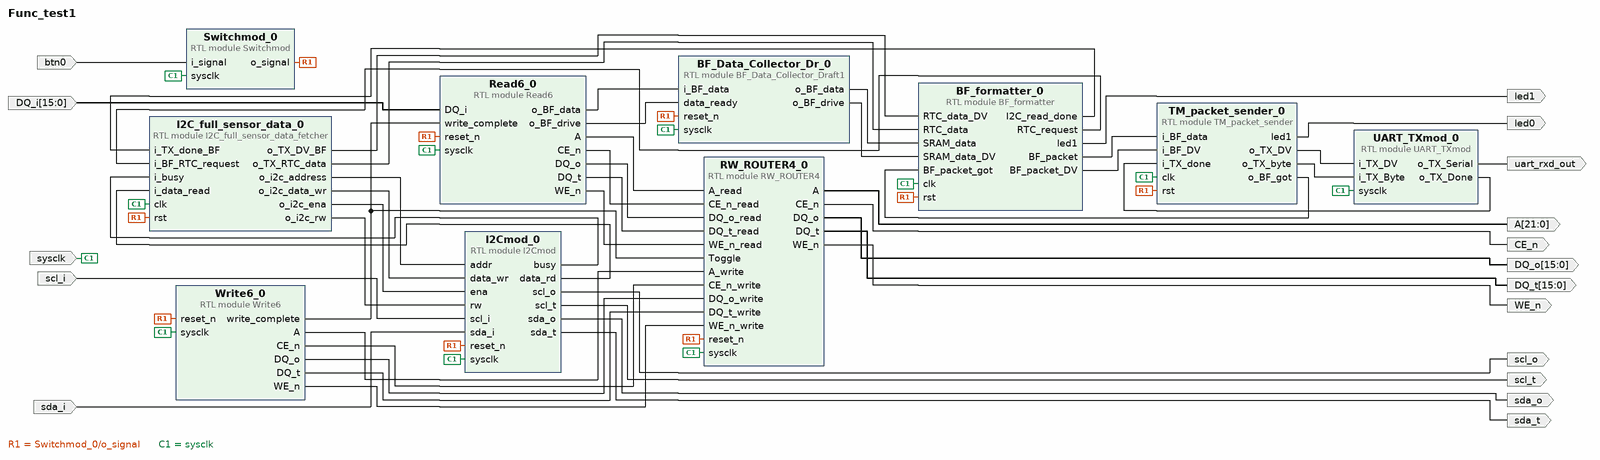
[diagram p0: block diagram of the top level]
# Vivado block design Func_test1, xc7a35tcpg236-1, Vivado 2024.2
create_bd_design Func_test1

create_bd_port -dir I sysclk
create_bd_port -dir I btn0
create_bd_port -dir O led0
create_bd_port -dir I -from 15 -to 0 DQ_i
create_bd_port -dir O -from 15 -to 0 DQ_o
create_bd_port -dir O -from 15 -to 0 DQ_t
create_bd_port -dir O WE_n
create_bd_port -dir O CE_n
create_bd_port -dir O -from 21 -to 0 A
create_bd_port -dir O led1
create_bd_port -dir I sda_i
create_bd_port -dir I scl_i
create_bd_port -dir O sda_o
create_bd_port -dir O uart_rxd_out
create_bd_port -dir O sda_t
create_bd_port -dir O scl_o
create_bd_port -dir O scl_t

create_bd_cell -type module -reference BF_Data_Collector_Draft1 BF_Data_Collector_Dr_0
create_bd_cell -type module -reference Read6 Read6_0
create_bd_cell -type module -reference Write6 Write6_0
create_bd_cell -type module -reference RW_ROUTER4 RW_ROUTER4_0
create_bd_cell -type module -reference Switchmod Switchmod_0
create_bd_cell -type module -reference BF_formatter BF_formatter_0
create_bd_cell -type module -reference I2C_full_sensor_data_fetcher I2C_full_sensor_data_0
create_bd_cell -type module -reference TM_packet_sender TM_packet_sender_0
create_bd_cell -type module -reference UART_TXmod UART_TXmod_0
create_bd_cell -type module -reference I2Cmod I2Cmod_0

# ---- connections ----

connect_bd_net [get_bd_pins BF_Data_Collector_Dr_0/o_BF_data] [get_bd_pins BF_formatter_0/SRAM_data]
connect_bd_net [get_bd_pins BF_Data_Collector_Dr_0/o_BF_drive] [get_bd_pins BF_formatter_0/SRAM_data_DV]
connect_bd_net [get_bd_pins BF_formatter_0/BF_packet] [get_bd_pins TM_packet_sender_0/i_BF_data]
connect_bd_net [get_bd_pins BF_formatter_0/BF_packet_DV] [get_bd_pins TM_packet_sender_0/i_BF_DV]
connect_bd_net [get_bd_pins BF_formatter_0/I2C_read_done] [get_bd_pins I2C_full_sensor_data_0/i_TX_done_BF]
connect_bd_net [get_bd_pins BF_formatter_0/RTC_request] [get_bd_pins I2C_full_sensor_data_0/i_BF_RTC_request]
connect_bd_net [get_bd_pins BF_formatter_0/led1] [get_bd_ports led1]
connect_bd_net -net DQ_i_0_1 [get_bd_ports DQ_i] [get_bd_pins Read6_0/DQ_i]
connect_bd_net [get_bd_pins I2C_full_sensor_data_0/o_TX_DV_BF] [get_bd_pins BF_formatter_0/RTC_data_DV]
connect_bd_net [get_bd_pins I2C_full_sensor_data_0/o_TX_RTC_data] [get_bd_pins BF_formatter_0/RTC_data]
connect_bd_net [get_bd_pins I2C_full_sensor_data_0/o_i2c_address] [get_bd_pins I2Cmod_0/addr]
connect_bd_net [get_bd_pins I2C_full_sensor_data_0/o_i2c_data_wr] [get_bd_pins I2Cmod_0/data_wr]
connect_bd_net [get_bd_pins I2C_full_sensor_data_0/o_i2c_ena] [get_bd_pins I2Cmod_0/ena]
connect_bd_net [get_bd_pins I2C_full_sensor_data_0/o_i2c_rw] [get_bd_pins I2Cmod_0/rw]
connect_bd_net [get_bd_pins I2Cmod_0/busy] [get_bd_pins I2C_full_sensor_data_0/i_busy]
connect_bd_net [get_bd_pins I2Cmod_0/data_rd] [get_bd_pins I2C_full_sensor_data_0/i_data_read]
connect_bd_net [get_bd_pins I2Cmod_0/scl_o] [get_bd_ports scl_o]
connect_bd_net [get_bd_pins I2Cmod_0/scl_t] [get_bd_ports scl_t]
connect_bd_net [get_bd_pins I2Cmod_0/sda_o] [get_bd_ports sda_o]
connect_bd_net [get_bd_pins I2Cmod_0/sda_t] [get_bd_ports sda_t]
connect_bd_net [get_bd_pins RW_ROUTER4_0/A] [get_bd_ports A]
connect_bd_net [get_bd_pins RW_ROUTER4_0/CE_n] [get_bd_ports CE_n]
connect_bd_net [get_bd_pins RW_ROUTER4_0/DQ_o] [get_bd_ports DQ_o]
connect_bd_net [get_bd_pins RW_ROUTER4_0/DQ_t] [get_bd_ports DQ_t]
connect_bd_net [get_bd_pins RW_ROUTER4_0/WE_n] [get_bd_ports WE_n]
connect_bd_net [get_bd_pins Read6_0/A] [get_bd_pins RW_ROUTER4_0/A_read]
connect_bd_net [get_bd_pins Read6_0/CE_n] [get_bd_pins RW_ROUTER4_0/CE_n_read]
connect_bd_net [get_bd_pins Read6_0/DQ_o] [get_bd_pins RW_ROUTER4_0/DQ_o_read]
connect_bd_net [get_bd_pins Read6_0/DQ_t] [get_bd_pins RW_ROUTER4_0/DQ_t_read]
connect_bd_net [get_bd_pins Read6_0/WE_n] [get_bd_pins RW_ROUTER4_0/WE_n_read]
connect_bd_net [get_bd_pins Read6_0/o_BF_data] [get_bd_pins BF_Data_Collector_Dr_0/i_BF_data]
connect_bd_net [get_bd_pins Read6_0/o_BF_drive] [get_bd_pins BF_Data_Collector_Dr_0/data_ready]
connect_bd_net [get_bd_pins Switchmod_0/o_signal] \
  [get_bd_pins RW_ROUTER4_0/reset_n] [get_bd_pins Write6_0/reset_n] [get_bd_pins BF_Data_Collector_Dr_0/reset_n] \
  [get_bd_pins I2C_full_sensor_data_0/rst] [get_bd_pins Read6_0/reset_n] [get_bd_pins TM_packet_sender_0/rst] \
  [get_bd_pins BF_formatter_0/rst] [get_bd_pins I2Cmod_0/reset_n]
connect_bd_net [get_bd_pins TM_packet_sender_0/led1] [get_bd_ports led0]
connect_bd_net [get_bd_pins TM_packet_sender_0/o_BF_got] [get_bd_pins BF_formatter_0/BF_packet_got]
connect_bd_net [get_bd_pins TM_packet_sender_0/o_TX_DV] [get_bd_pins UART_TXmod_0/i_TX_DV]
connect_bd_net [get_bd_pins TM_packet_sender_0/o_TX_byte] [get_bd_pins UART_TXmod_0/i_TX_Byte]
connect_bd_net [get_bd_pins UART_TXmod_0/o_TX_Done] [get_bd_pins TM_packet_sender_0/i_TX_done]
connect_bd_net [get_bd_pins UART_TXmod_0/o_TX_Serial] [get_bd_ports uart_rxd_out]
connect_bd_net [get_bd_pins Write6_0/A] [get_bd_pins RW_ROUTER4_0/A_write]
connect_bd_net [get_bd_pins Write6_0/CE_n] [get_bd_pins RW_ROUTER4_0/CE_n_write]
connect_bd_net [get_bd_pins Write6_0/DQ_o] [get_bd_pins RW_ROUTER4_0/DQ_o_write]
connect_bd_net [get_bd_pins Write6_0/DQ_t] [get_bd_pins RW_ROUTER4_0/DQ_t_write]
connect_bd_net [get_bd_pins Write6_0/WE_n] [get_bd_pins RW_ROUTER4_0/WE_n_write]
connect_bd_net [get_bd_pins Write6_0/write_complete] [get_bd_pins RW_ROUTER4_0/Toggle] [get_bd_pins Read6_0/write_complete]
connect_bd_net -net i_signal_0_1 [get_bd_ports btn0] [get_bd_pins Switchmod_0/i_signal]
connect_bd_net [get_bd_ports scl_i] [get_bd_pins I2Cmod_0/scl_i]
connect_bd_net [get_bd_ports sda_i] [get_bd_pins I2Cmod_0/sda_i]
connect_bd_net -net sysclk_0_1 [get_bd_ports sysclk] \
  [get_bd_pins Switchmod_0/sysclk] [get_bd_pins RW_ROUTER4_0/sysclk] [get_bd_pins Write6_0/sysclk] \
  [get_bd_pins UART_TXmod_0/sysclk] [get_bd_pins BF_Data_Collector_Dr_0/sysclk] [get_bd_pins I2C_full_sensor_data_0/clk] \
  [get_bd_pins Read6_0/sysclk] [get_bd_pins TM_packet_sender_0/clk] [get_bd_pins BF_formatter_0/clk] \
  [get_bd_pins I2Cmod_0/sysclk]

validate_bd_design
save_bd_design
